# EAGLE design GCtoUSBv1_2 (EAGLE 6.2)
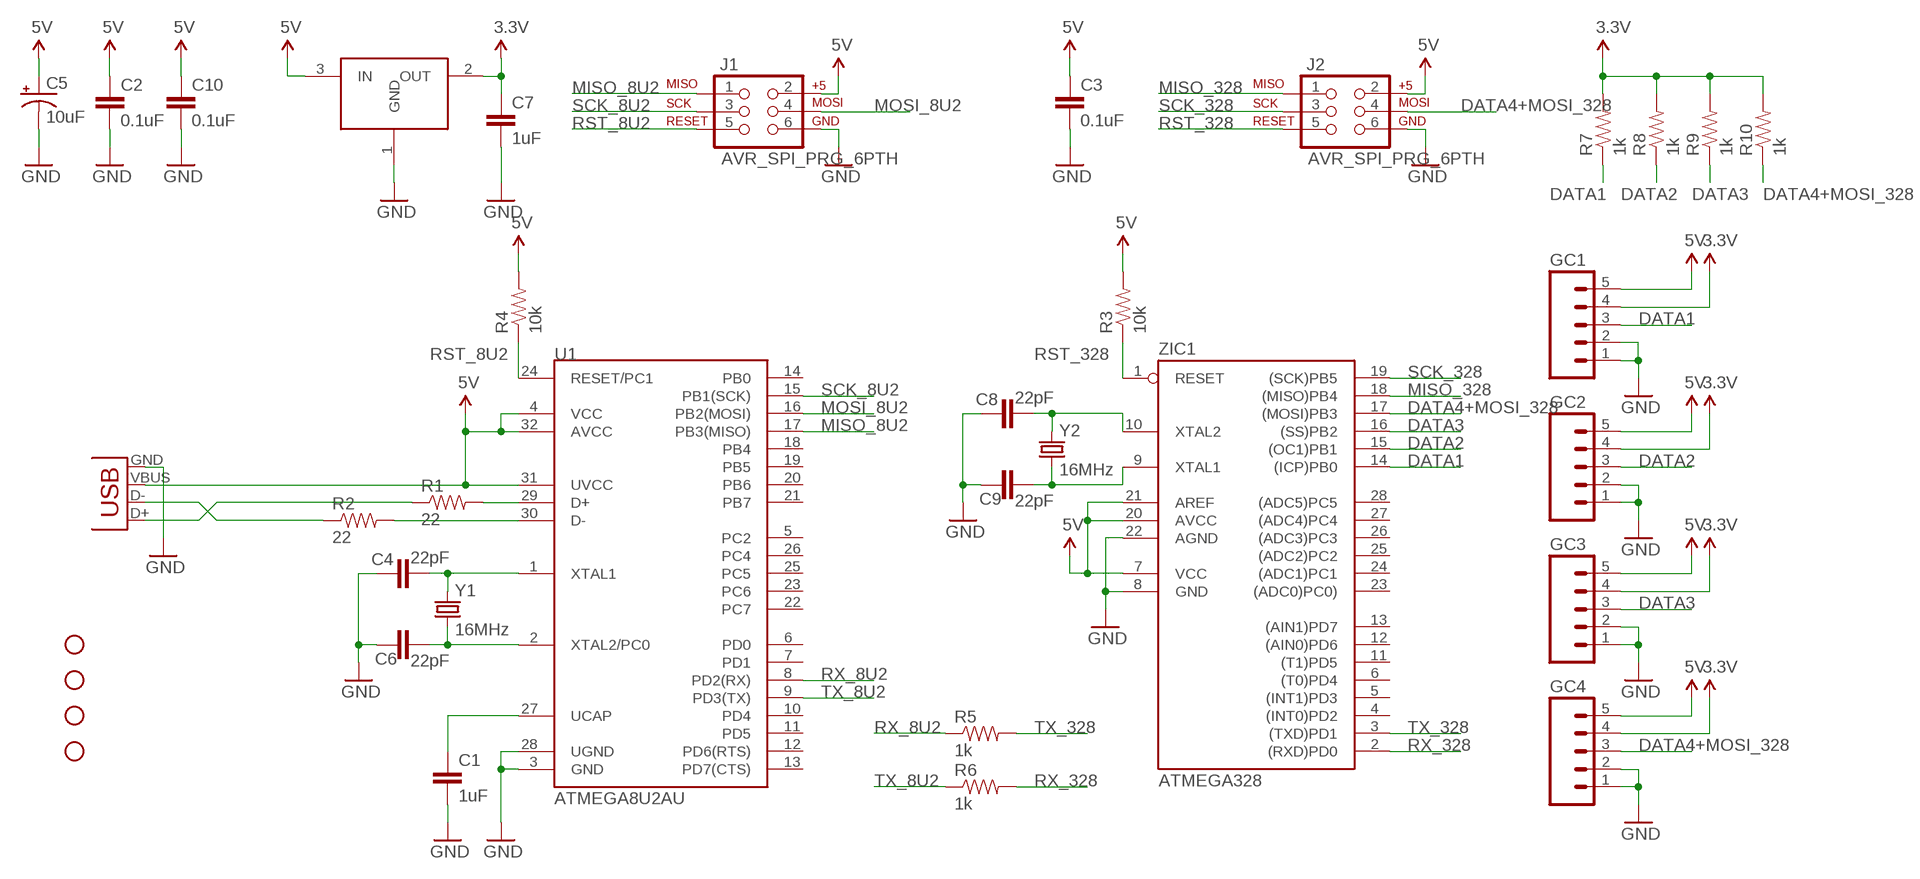
[diagram p0: schematic, sheet 1]

## Parts
C1  1uF  CAPPTH1  [CAP-PTH-5MM]
C2  0.1uF  CAPPTH  [CAP-PTH-SMALL]
C3  0.1uF  CAPPTH  [CAP-PTH-SMALL]
C4  22pF  CAPPTH  [CAP-PTH-SMALL]
C5  10uF  CAP_POLPTH2  [CPOL-RADIAL-10UF-25V]
C6  22pF  CAPPTH  [CAP-PTH-SMALL]
C7  1uF  CAPPTH1  [CAP-PTH-5MM]
C8  22pF  CAPPTH  [CAP-PTH-SMALL]
C9  22pF  CAPPTH  [CAP-PTH-SMALL]
C10  0.1uF  CAPPTH  [CAP-PTH-SMALL]
GC1  M05PTH  [1X05]
GC2  M05PTH  [1X05]
GC3  M05PTH  [1X05]
GC4  M05PTH  [1X05]
J1  AVR_SPI_PRG_6PTH  [2X3]
J2  AVR_SPI_PRG_6PTH  [2X3]
JP5  STAND-OFF  [STAND-OFF]
JP6  STAND-OFF  [STAND-OFF]
JP7  STAND-OFF  [STAND-OFF]
JP8  STAND-OFF  [STAND-OFF]
R1  22  RESISTORPTH-1/4W  [AXIAL-0.4]
R2  22  RESISTORPTH-1/4W  [AXIAL-0.4]
R3  10k  RESISTORPTH-1/4W  [AXIAL-0.4]
R4  10k  RESISTORPTH-1/4W  [AXIAL-0.4]
R5  1k  RESISTORPTH-1/4W  [AXIAL-0.4]
R6  1k  RESISTORPTH-1/4W  [AXIAL-0.4]
R7  1k  RESISTORPTH-1/4W  [AXIAL-0.4]
R8  1k  RESISTORPTH-1/4W  [AXIAL-0.4]
R9  1k  RESISTORPTH-1/4W  [AXIAL-0.4]
R10  1k  RESISTORPTH-1/4W  [AXIAL-0.4]
U1  ATMEGA8U2AU  [TQFP32-08]
U$16  TO220-LDOTO  [TO220V]
X1  USB-MB-H  [USB-MB-H]
Y1  16MHz  CRYSTALHC49US  [HC49US]
Y2  16MHz  CRYSTALHC49US  [HC49US]
ZIC1  ATMEGA328  AT90S4433P  [DIL28-3]

## Nets
3.3V: C7.1 GC1.4 GC2.4 GC3.4 GC4.4 R7.P$2 R8.P$2 R9.P$2 R10.P$2 U$16.2(OUT)
5V: C2.1 C3.1 C5.1(+) C10.1 GC1.5 GC2.5 GC3.5 GC4.5 J1.2 J2.2 R3.P$2 R4.P$2 U1.4(VCC) U1.31(UVCC) U1.32(AVCC) U$16.3(IN) X1.VBUS ZIC1.7(VCC) ZIC1.20(AVCC) ZIC1.21(AREF)
DATA1: GC1.3 R7.P$1 ZIC1.14((ICP)PB0)
DATA2: GC2.3 R8.P$1 ZIC1.15((OC1)PB1)
DATA3: GC3.3 R9.P$1 ZIC1.16((SS)PB2)
DATA4+MOSI_328: GC4.3 J2.4 R10.P$1 ZIC1.17((MOSI)PB3)
GND: C1.2 C2.2 C3.2 C4.2 C5.2(-) C6.2 C7.2 C8.2 C9.2 C10.2 GC1.1 GC1.2 GC2.1 GC2.2 GC3.1 GC3.2 GC4.1 GC4.2 J1.6 J2.6 U1.3(GND) U1.28(UGND) U$16.1(GND) X1.GND ZIC1.8(GND) ZIC1.22(AGND)
MISO_8U2: J1.1 U1.17(PB3(MISO))
MISO_328: J2.1 ZIC1.18((MISO)PB4)
MOSI_8U2: J1.4 U1.16(PB2(MOSI))
N$1: C8.1 Y2.2 ZIC1.10(XTAL2)
N$2: C9.1 Y2.1 ZIC1.9(XTAL1)
N$3: R1.P$2 U1.29(D+)
N$4: R2.P$2 U1.30(D-)
N$5: R1.P$1 X1.D+
N$6: R2.P$1 X1.D-
N$8: C4.1 U1.1(XTAL1) Y1.2
N$9: C6.1 U1.2(XTAL2/PC0) Y1.1
N$12: C1.1 U1.27(UCAP)
RST_8U2: J1.5 R4.P$1 U1.24(RESET/PC1)
RST_328: J2.5 R3.P$1 ZIC1.1(RESET)
RX_8U2: R5.P$1 U1.8(PD2(RX))
RX_328: R6.P$2 ZIC1.2((RXD)PD0)
SCK_8U2: J1.3 U1.15(PB1(SCK))
SCK_328: J2.3 ZIC1.19((SCK)PB5)
TX_8U2: R6.P$1 U1.9(PD3(TX))
TX_328: R5.P$2 ZIC1.3((TXD)PD1)
Unconnected: U1.5(PC2) U1.6(PD0) U1.7(PD1) U1.10(PD4) U1.11(PD5) U1.12(PD6(RTS)) U1.13(PD7(CTS)) U1.14(PB0) U1.18(PB4) U1.19(PB5) U1.20(PB6) U1.21(PB7) U1.22(PC7) U1.23(PC6) U1.25(PC5) U1.26(PC4) ZIC1.4((INT0)PD2) ZIC1.5((INT1)PD3) ZIC1.6((T0)PD4) ZIC1.11((T1)PD5) ZIC1.12((AIN0)PD6) ZIC1.13((AIN1)PD7) ZIC1.23((ADC0)PC0)) ZIC1.24((ADC1)PC1) ZIC1.25((ADC2)PC2) ZIC1.26((ADC3)PC3) ZIC1.27((ADC4)PC4) ZIC1.28((ADC5)PC5)

## Library data of the parts
C1-C4 C6-C10 = SparkFun:CAP: Capacitor Standard 0603 ceramic capacitor, and 0.1" leaded capacitor.
C5 = SparkFun:CAP_POL: Capacitor Polarized These are standard SMD and PTH capacitors. Normally 10uF, 47uF, and 100uF in electrolytic and tantalum varieties. Always verify the external diameter of the through hole cap, it varies with capacity, voltage, and manufacturer. The EIA devices should be standard.
GC1-GC4 = SparkFun:M05: Header 5 Standard 5-pin 0.1" header. Use with straight break away headers (SKU : PRT-00116), right angle break away headers (PRT-00553), swiss pins (PRT-00743), machine pins (PRT-00117), and female headers (PRT-00115). Molex polarized connector foot print use with SKU : PRT-08230 with associated crimp pins and housings.
J1 J2 = SparkFun:AVR_SPI_PRG_6: AVR ISP 6 Pin This is the reduced ISP connector for AVR programming. Common on Arduino. This footprint will take up less PCB space and can be used with a 10-pin to 6-pin adapter such as SKU: BOB-08508
JP5-JP8 = SparkFun:STAND-OFF: Stand Off This is the mechanical footprint for a #4 phillips button head screw. Use the keepout ring to avoid running the screw head into surrounding components. SKU : PRT-00447
R1-R10 = SparkFun:RESISTOR: Resistor Basic schematic elements and footprints for 0603, 1206, and PTH resistors.
U1 = SparkFun:ATMEGA8U2: Atmel 8-bit Microcontroller with 8/16/32K Bystes of ISP Flash and USB Controller. ATmega8U2, ATmega16U2, and ATmega32U2
U$16 = SparkFun:TO220-LDO
X1 = SparkFun:USB: USB Connectors USB-B-PTH is fully proven SKU : PRT-00139 USB-miniB is fully proven SKU : PRT-00587 USB-A-PCB is untested. USB-A-H is throughly reviewed, but untested. Spark Fun Electronics SKU : PRT-00437 USB-B-SMT is throughly reviewed, but untested. Needs silkscreen touching up. USB-A-S has not been used/tested USB-MB-H has not been used/tested
Y1 Y2 = SparkFun:CRYSTAL: Crystals Various standard crystals. Proven footprints. Spark Fun Electronics SKU : COM-00534
ZIC1 = atmel:AT90S4433: MICROCONTROLLER 4 Kbytes FLASH 128 bytes SRAM 256 bytes EEPROM UART 6-channel 10 bit ADC

## Net classes
0 default: width 0.203 mm, clearance 0.203 mm

## Board
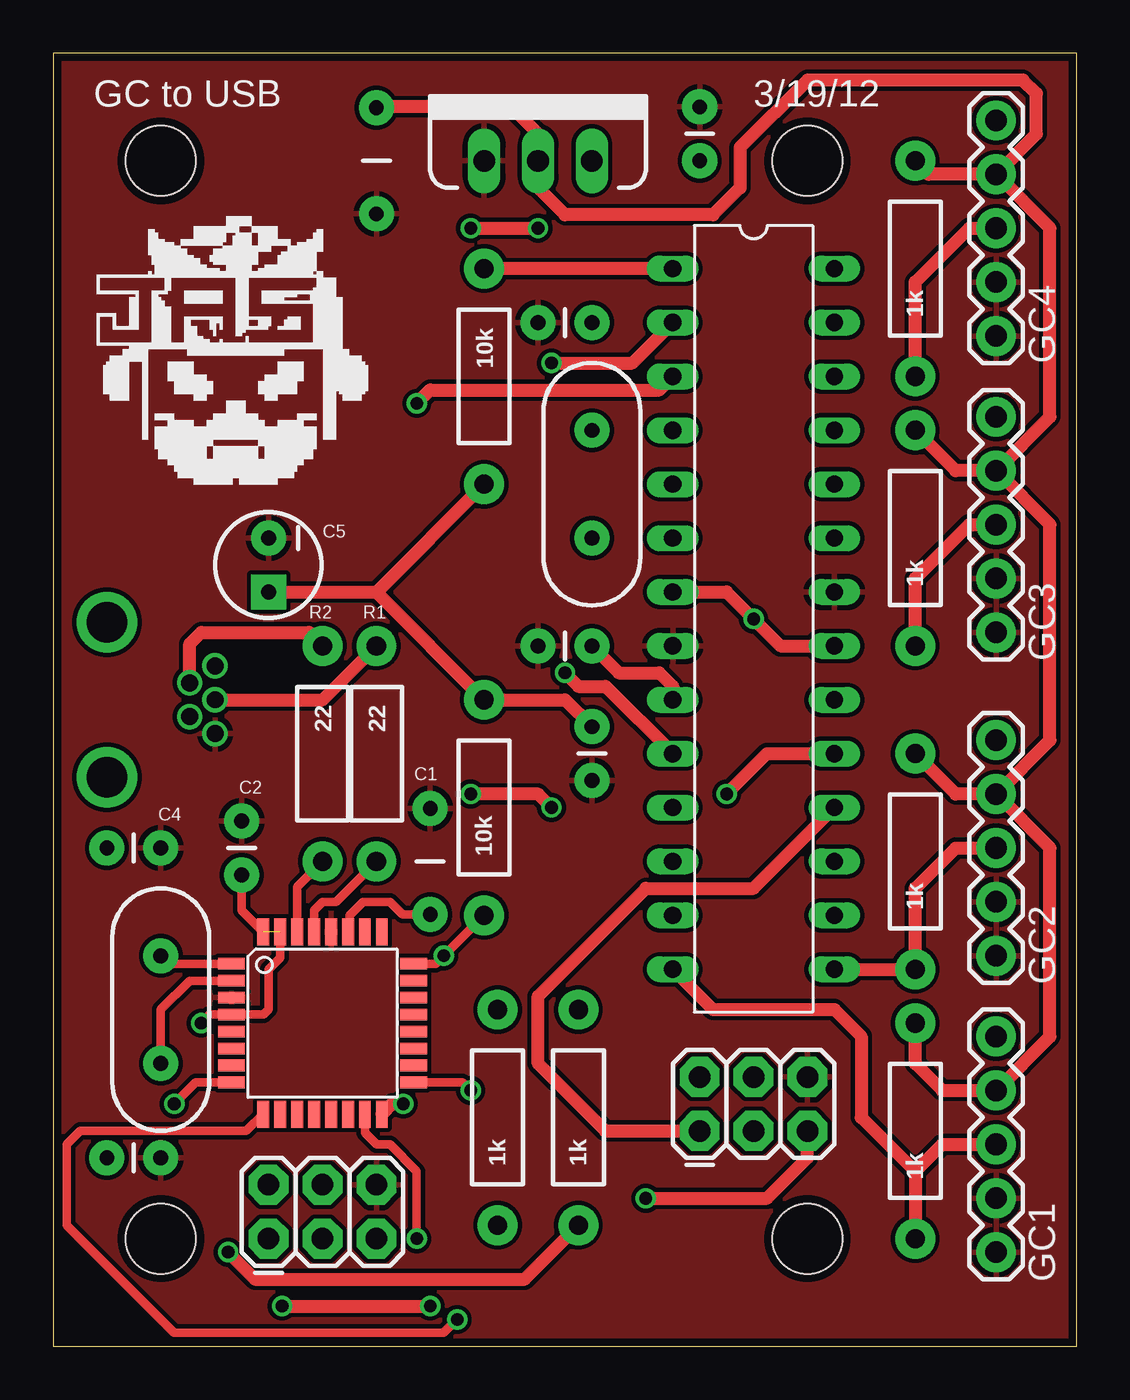
[diagram p1: board, top side]
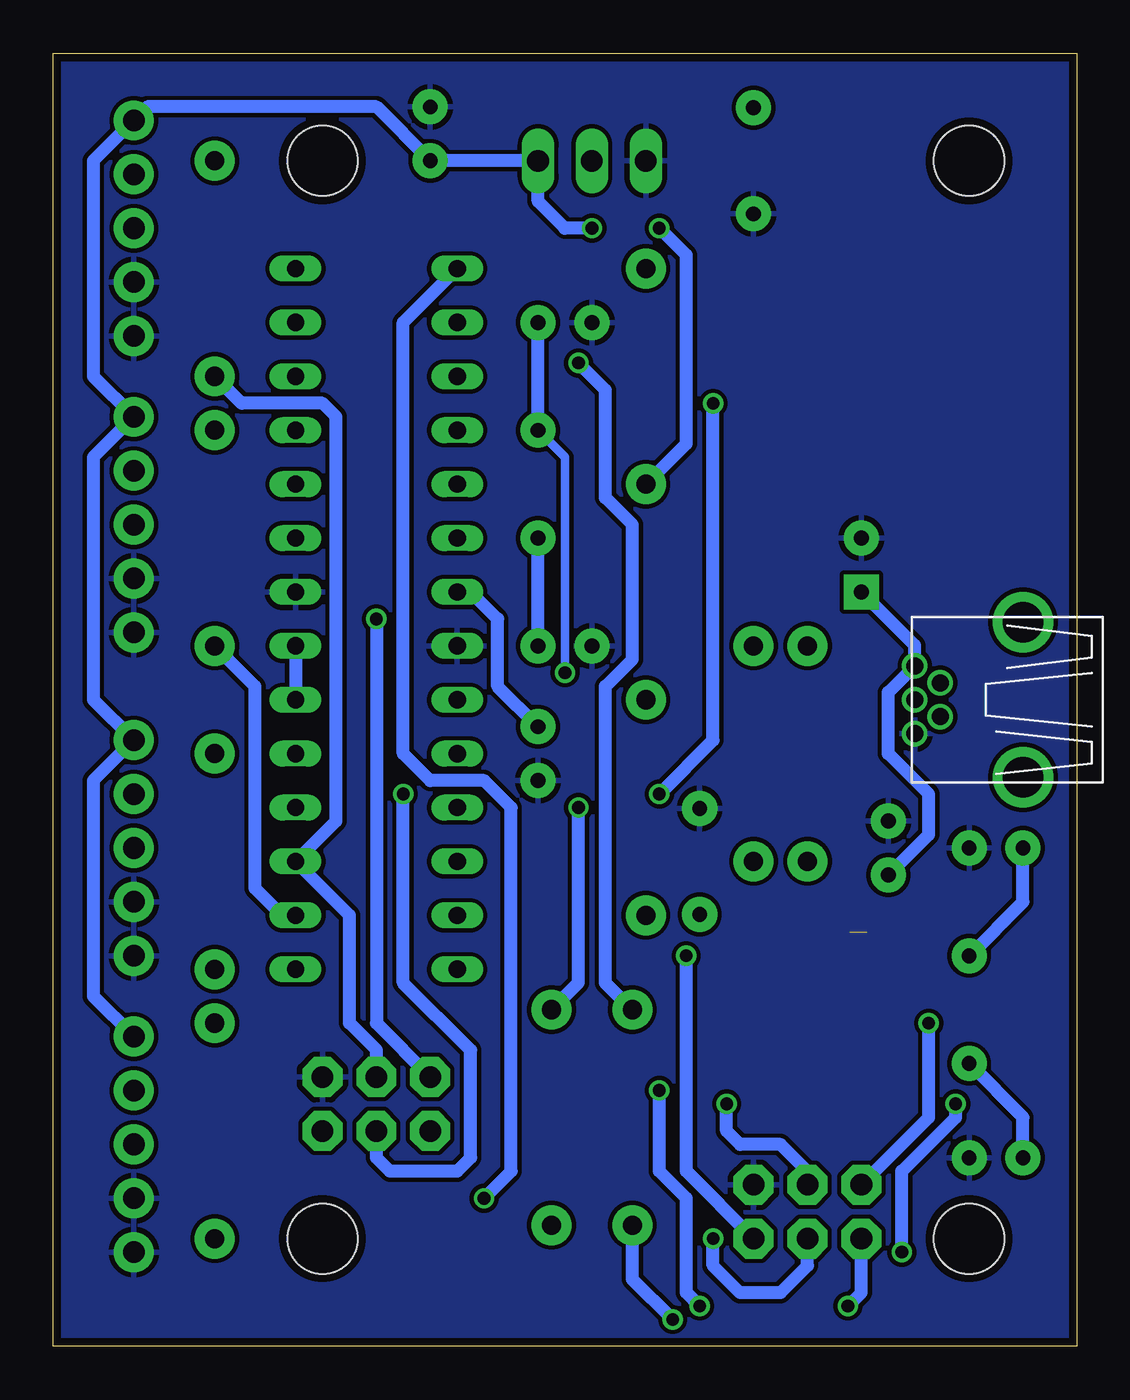
[diagram p2: board, bottom side, seen from below]

Size 48.26 x 60.96 mm. Coordinates in mm from the lower left corner, seen from the top.
Outline: 0,0 48.26,0 48.26,60.96 0,60.96 0,0
Copper layers (1*16): Top 0.0356mm / dielectric 1.5011mm / Bottom 0.0356mm
Design rules: minimum track width 6mil, minimum drill 13mil, track to track 6mil, track to pad 6mil, pad to pad 6mil, via to via 6mil, smd to smd 6mil, copper to edge 15mil, drill to drill 6mil, minimum pad ring 7mil, minimum via ring 7mil, stop-mask expansion 4mil, vias tented up to drill 0mil, thermal gap 10mil

### Footprints (pad centres in the part's own frame; a part is rotated, then mirrored left to right if it is on the bottom)
CAP-PTH-5MM = drill 0.7 pad 1.651: 1 -2.5,0; 2 2.5,0
CAP-PTH-SMALL = drill 0.7 pad 1.651: 1 0,0; 2 2.54,0
CPOL-RADIAL-10UF-25V = drill 0.7 pad 1.651 square: 1 1.27,0 | drill 0.7 pad 1.651: 2 -1.27,0
1X05 = drill 1.016 pad 1.88: 1 0,0; 2 2.54,0; 3 5.08,0; 4 7.62,0; 5 10.16,0
2X3 = drill 1.016 pad 1.88 octagon: 1 0,0; 2 0,2.54; 3 2.54,0; 4 2.54,2.54; 5 5.08,0; 6 5.08,2.54
STAND-OFF = hole 3.302: 0,0
AXIAL-0.4 = drill 0.9 pad 1.88: P$1 -5.08,0; P$2 5.08,0
TQFP32-08 = smd 1.27 x 0.559: 1 -4.293,2.8; 2 -4.293,2; 3 -4.293,1.2; 4 -4.293,0.4; 5 -4.293,-0.4; 6 -4.293,-1.2; 7 -4.293,-2; 8 -4.293,-2.8; 17 4.293,-2.8; 18 4.293,-2; 19 4.293,-1.2; 20 4.293,-0.4; 21 4.293,0.4; 22 4.293,1.2; 23 4.293,2; 24 4.293,2.8 | smd 0.559 x 1.27: 9 -2.8,-4.293; 10 -2,-4.293; 11 -1.2,-4.293; 12 -0.4,-4.293; 13 0.4,-4.293; 14 1.2,-4.293; 15 2,-4.293; 16 2.8,-4.293; 25 2.8,4.293; 26 2,4.293; 27 1.2,4.293; 28 0.4,4.293; 29 -0.4,4.293; 30 -1.2,4.293; 31 -2,4.293; 32 -2.8,4.293
TO220V = drill 1.016 long: 1 -2.54,0; 2 0,0; 3 2.54,0
USB-MB-H = drill 0.8: D+ 5.1,0; D- 3.9,0.8; GND 5.1,-1.6; ID 3.9,-0.8; VBUS 5.1,1.6 | drill 1.9: P$6 0,-3.65; P$7 0,3.65
HC49US = drill 0.7 pad 1.651: 1 -2.54,0; 2 2.54,0
DIL28-3 = drill 0.813 long: 1 -16.51,-3.81; 2 -13.97,-3.81; 3 -11.43,-3.81; 4 -8.89,-3.81; 5 -6.35,-3.81; 6 -3.81,-3.81; 7 -1.27,-3.81; 8 1.27,-3.81; 9 3.81,-3.81; 10 6.35,-3.81; 11 8.89,-3.81; 12 11.43,-3.81; 13 13.97,-3.81; 14 16.51,-3.81; 15 16.51,3.81; 16 13.97,3.81; 17 11.43,3.81; 18 8.89,3.81; 19 6.35,3.81; 20 3.81,3.81; 21 1.27,3.81; 22 -1.27,3.81; 23 -3.81,3.81; 24 -6.35,3.81; 25 -8.89,3.81; 26 -11.43,3.81; 27 -13.97,3.81; 28 -16.51,3.81

### Placement (x,y rotation side)
C1  17.78,22.86 90 top
C2  8.89,22.23 90 top
C3  25.4,29.21 270 top
C4  2.54,23.5 0 top
C5  10.16,36.83 270 top
C6  2.54,8.89 0 top
C7  15.24,55.88 270 top
C8  25.4,48.26 180 top
C9  25.4,33.02 180 top
C10  30.48,55.88 90 top
GC1  44.45,4.45 90 top
GC2  44.45,18.41 90 top
GC3  44.45,33.66 90 top
GC4  44.45,47.62 90 top
J1  10.16,5.08 0 top
J2  30.48,10.16 0 top
JP5  5.08,5.08 0 top
JP6  35.56,5.08 0 top
JP7  5.08,55.88 0 top
JP8  35.56,55.88 0 top
R1  15.24,27.94 270 top
R2  12.7,27.94 270 top
R3  20.32,45.72 270 top
R4  20.32,25.4 90 top
R5  24.77,10.79 90 top
R6  20.95,10.79 90 top
R7  40.64,10.16 90 top
R8  40.64,22.86 90 top
R9  40.64,38.1 90 top
R10  40.64,50.8 90 top
U1  12.7,15.24 0 top
U$16  22.86,55.88 0 top
X1  2.54,30.48 0 top
Y1  5.08,15.88 90 top
Y2  25.4,40.64 90 top
ZIC1  33.02,34.29 270 top

### Tracks (layer width: path | path; a pad name or v marks a point on that pad's centre or on a via)
3.3V
  Top 0.61: C7.1 15.28,58.42 21.59,58.42 22.86,57.15 U$16.2 22.86,54.61 24.13,53.34 31.11,53.34 32.38,54.61 32.38,56.52 35.56,59.69 45.72,59.69 46.35,59.05 46.35,57.15 GC4.4 | GC3.4 42.55,41.27 R9.P$2 | GC4.4 41.27,55.24 R10.P$2 | GC2.4 42.55,26.04 R8.P$2 | R7.P$2 40.64,13.34 41.91,12.06 GC1.4 46.99,14.61 46.99,23.5 GC2.4 | GC4.4 46.99,52.7 46.99,43.81 GC3.4 | GC3.4 46.99,38.73 46.99,28.57 GC2.4
5V  (via drill 0.6)  (1 unrouted)
  Top 0.406: U1.32 8.89,20.54 C2.1 | v6.99,15.24 7.38,15.64 U1.4 9.93,15.64 10.16,15.88 10.16,17.78 10.7,18.32 U1.31
  Top 0.61: C5.1 15.24,35.56 | 15.24,35.56 R4.P$2 24.13,30.48 C3.1 | ZIC1.7 31.75,35.56 v33.02,34.29 34.29,33.02 ZIC1.21 | 15.24,35.56 R3.P$2 | v19.68,52.7 v22.86,52.7
  Bottom 0.61: GC1.5 46.35,16.51 46.35,26.67 GC2.5 46.35,30.48 46.35,41.91 GC3.5 46.35,45.72 46.35,55.88 GC4.5 43.81,58.42 33.02,58.42 C10.1 U$16.3 25.4,53.98 24.13,52.7 v22.86,52.7 | C5.1 7.64,33.04 X1.VBUS 8.89,30.83 8.89,27.94 6.99,26.04 6.99,24.13 C2.1 | C3.1 27.3,31.11 27.3,34.29 28.57,35.56 ZIC1.7 | J2.2 33.02,15.24 v33.02,34.29 | R3.P$2 18.41,42.55 18.41,51.44 v19.68,52.7 | ZIC1.21 ZIC1.20 | J1.2 6.99,10.79 v6.99,15.24
DATA1
  Top 0.61: GC1.3 41.91,9.53 40.64,8.26 | 40.64,8.26 R7.P$1 | 40.64,8.26 38.1,10.79 38.1,14.61 36.83,15.88 31.11,15.88 ZIC1.14
DATA2
  Top 0.61: GC2.3 42.55,23.5 40.64,21.59 R8.P$1 ZIC1.15
DATA3
  Top 0.61: GC3.3 43.18,38.73 40.64,36.2 R9.P$1
  Bottom 0.61: ZIC1.16 37.47,20.32 38.73,21.59 38.73,31.11 R9.P$1
DATA4+MOSI_328
  Top 0.61: GC4.3 43.18,52.7 40.64,50.16 R10.P$1
  Bottom 0.61: J2.4 33.02,13.97 34.29,15.24 34.29,20.32 ZIC1.17 34.92,24.77 34.92,43.81 35.56,44.45 39.37,44.45 R10.P$1
GND
  pour Top: 0,0 0,60.96 48.26,60.96 48.26,0
  pour Bottom: 0,0 0,60.96 48.26,60.96 48.26,0
MISO_8U2  (via drill 0.6)
  Top 0.406: U1.17 19.31,12.44 v19.68,12.06
  Top 0.61: v10.79,1.91 v17.78,1.91
  Bottom 0.61: J1.1 10.16,2.54 v10.79,1.91 | v19.68,12.06 19.68,8.26 18.41,6.99 18.41,2.54 v17.78,1.91
MISO_328
  Top 0.61: J2.1 26.04,10.16 22.86,13.34 22.86,16.51 27.94,21.59 33.02,21.59 ZIC1.18
MOSI_8U2  (via drill 0.6)
  Top 0.61: v16.51,11.43 15.98,11.43 U1.16
  Bottom 0.61: J1.4 12.7,8.26 13.97,9.53 15.88,9.53 16.51,10.16 v16.51,11.43
N$1  (via drill 0.6)
  Top 0.61: ZIC1.10 26.04,31.11 24.77,31.11 v24.13,31.75
  Bottom 0.406: v24.13,31.75 24.13,41.91 Y2.2
  Bottom 0.61: Y2.2 C8.1
N$2
  Top 0.61: ZIC1.9 29.21,31.11 28.57,31.75 26.67,31.75 C9.1
  Bottom 0.61: C9.1 Y2.1
N$3
  Top 0.406: R1.P$2 13.34,20.95 12.7,20.95 12.3,20.55 U1.29
N$4
  Top 0.406: R2.P$2 11.5,21.66 U1.30
N$5
  Top 0.61: X1.D+ 12.7,30.48 R1.P$1
N$6
  Top 0.61: X1.D- 6.44,33.11 6.99,33.66 12.06,33.66 R2.P$1
N$8
  Top 0.406: 5.46,18.04 U1.1
  Top 0.61: Y1.2 5.46,18.04
  Bottom 0.61: Y1.2 2.54,20.95 C4.1
N$9
  Top 0.406: U1.2 6.45,17.24 5.08,15.88 Y1.1
  Bottom 0.61: Y1.1 2.54,10.79 C6.1
N$12
  Top 0.406: C1.1 16.47,20.36 15.88,20.95 14.61,20.95 13.97,20.32 13.97,19.6 U1.27
RST_8U2  (via drill 0.6)
  Top 0.406: R4.P$1 v18.41,18.41 18.04,18.04 U1.24
  Bottom 0.61: v18.41,18.41 18.41,8.26 J1.5
RST_328  (via drill 0.6)
  Top 0.61: ZIC1.1 R3.P$1 | v27.94,6.99 33.66,6.99 35.56,8.89 J2.5
  Bottom 0.61: v27.94,6.99 26.67,8.26 26.67,25.4 27.94,26.67 30.48,26.67 31.75,27.94 31.75,48.26 ZIC1.1
RX_8U2  (via drill 0.6)
  Top 0.406: U1.8 6.72,12.44 v5.71,11.43
  Top 0.61: v8.26,4.45 9.53,3.17 22.23,3.17 R5.P$1
  Bottom 0.61: v5.71,11.43 5.71,10.79 8.26,8.26 v8.26,4.45
RX_328  (via drill 0.6)
  Top 0.61: v23.5,46.35 27.3,46.35 ZIC1.2
  Bottom 0.61: R6.P$2 22.23,17.14 22.23,31.11 20.95,32.38 20.95,38.73 22.23,40.01 22.23,45.09 v23.5,46.35
SCK_8U2  (via drill 0.6)
  Top 0.406: v17.14,5.08 17.14,8.26 15.88,9.53 15.24,9.53 14.7,10.06 U1.15
  Bottom 0.61: J1.3 12.7,3.81 13.97,2.54 15.88,2.54 17.14,3.81 v17.14,5.08
SCK_328  (via drill 0.6)
  Top 0.61: v31.75,26.04 33.66,27.94 ZIC1.19
  Bottom 0.61: J2.3 33.02,8.89 32.38,8.26 29.21,8.26 28.57,8.89 28.57,13.97 31.75,17.14 v31.75,26.04
TX_8U2  (via drill 0.6)
  Top 0.406: v19.05,1.27 18.41,0.64 5.71,0.64 0.64,5.71 0.64,9.53 1.27,10.16 9.11,10.16 U1.9
  Bottom 0.61: R6.P$1 20.95,3.17 v19.05,1.27
TX_328  (via drill 0.6)
  Top 0.61: ZIC1.3 28.57,45.09 17.78,45.09 v17.14,44.45 | v19.68,26.04 22.86,26.04 v23.5,25.4
  Bottom 0.61: v17.14,44.45 17.14,28.57 v19.68,26.04 | v23.5,25.4 23.5,17.14 R5.P$2

### Text on the board
tPlace: GC to USB | 3/19/12